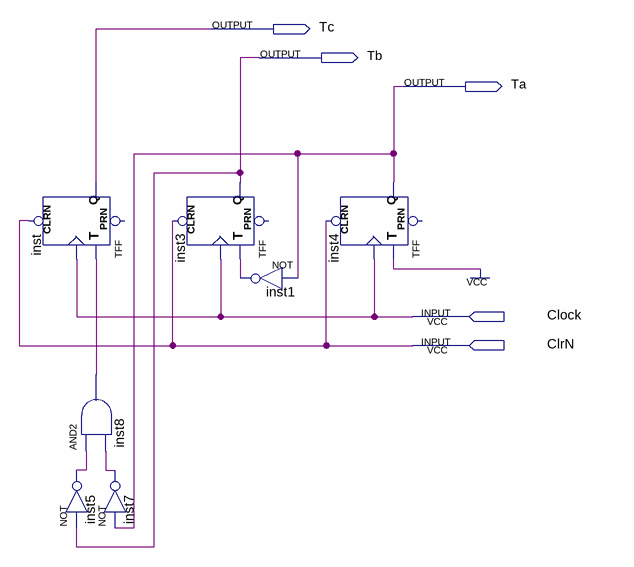
[diagram p0: schematic sheet]
// Quartus schematic TFFU2.bdf as structural Verilog: 7 symbols, 5 pins
module TFFU2 (
  input  Clock,
  input  ClrN,
  output Tc,
  output Tb,
  output Ta
);

  wire inst1_out, inst5_out, inst7_out, inst8_out;

  TFF inst (.CLRN(ClrN), .T(inst8_out), .CLK(Clock), .Q(Tc));  // open: PRN
  not inst5 (inst5_out, Tb);
  and inst8 (inst8_out, inst5_out, inst7_out);
  not inst7 (inst7_out, Ta);
  TFF inst3 (.CLRN(ClrN), .T(inst1_out), .CLK(Clock), .Q(Tb));  // open: PRN
  not inst1 (inst1_out, Ta);
  TFF inst4 (.CLRN(ClrN), .T(1'b1), .CLK(Clock), .Q(Ta));  // open: PRN
endmodule
